# EAGLE design umodular_midi4_rev02 (EAGLE 7.2.0)
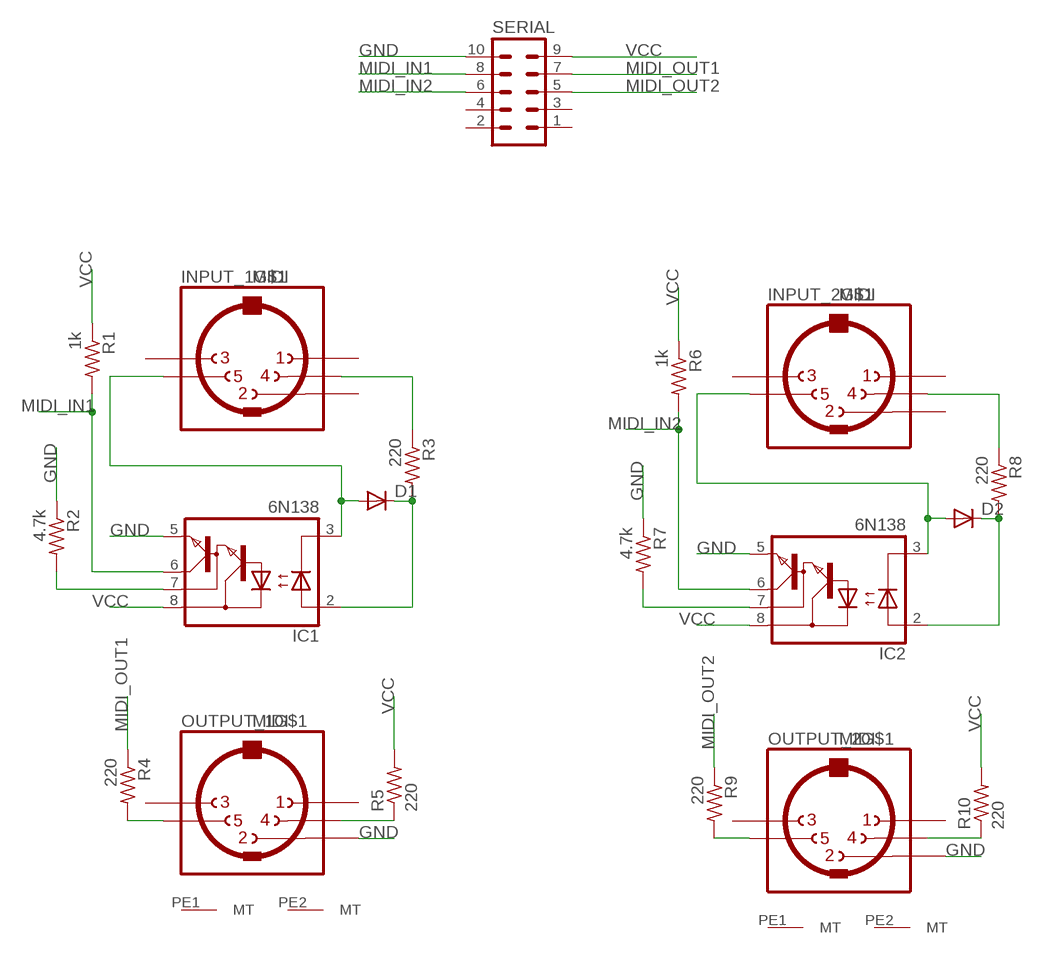
[diagram p0: schematic, sheet 1]

## Parts
D1  1N4148DO35-7  [DO35-7]
D2  1N4148DO35-7  [DO35-7]
IC1  6N138  [DIL08]
IC2  6N138  [DIL08]
INPUT_1  MIDI  MIDIJACK  [CP-2350]
INPUT_2  MIDI  MIDIJACK  [CP-2350]
OUTPUT_1  MIDI  MIDIJACK  [CP-2350]
OUTPUT_2  MIDI  MIDIJACK  [CP-2350]
R1  1k  R-US_0204/7  [0204/7@1]
R2  4.7k  R-US_0204/7  [0204/7@1]
R3  220  R-US_0204/7  [0204/7@1]
R4  220  R-US_0204/7  [0204/7@1]
R5  220  R-US_0204/7  [0204/7@1]
R6  1k  R-US_0204/7  [0204/7@1]
R7  4.7k  R-US_0204/7  [0204/7@1]
R8  220  R-US_0204/7  [0204/7@1]
R9  220  R-US_0204/7  [0204/7@1]
R10  220  R-US_0204/7  [0204/7@1]
SERIAL  MA05-2  [MA05-2]

## Nets
GND: IC1.5(GND) IC2.5(GND) OUTPUT_1.2 OUTPUT_2.2 R2.1 R7.1 SERIAL.10
MIDI_IN1: IC1.6(VO) R1.2 SERIAL.8
MIDI_IN2: IC2.6(VO) R6.2 SERIAL.6
MIDI_OUT1: R4.1 SERIAL.7
MIDI_OUT2: R9.1 SERIAL.5
N$1: OUTPUT_2.4 R10.1
N$2: OUTPUT_2.5 R9.2
N$3: INPUT_2.4 R8.1
N$4: D2.C IC2.2(A) R8.2
N$5: D2.A IC2.3(C) INPUT_2.5
N$6: IC2.7(VB) R7.2
N$330: INPUT_1.4 R3.1
N$331: OUTPUT_1.4 R5.1
N$332: OUTPUT_1.5 R4.2
N$333: D1.C IC1.2(A) R3.2
N$336: D1.A IC1.3(C) INPUT_1.5
N$337: IC1.7(VB) R2.2
VCC: IC1.8(VCC) IC2.8(VCC) R1.1 R5.2 R6.1 R10.2 SERIAL.9
Unconnected: INPUT_1.1 INPUT_1.2 INPUT_1.3 INPUT_1.PE1(MT) INPUT_1.PE2(MT) INPUT_1.PE(MT) INPUT_1.PE@(MT) INPUT_2.1 INPUT_2.2 INPUT_2.3 INPUT_2.PE1(MT) INPUT_2.PE2(MT) INPUT_2.PE(MT) INPUT_2.PE@(MT) OUTPUT_1.1 OUTPUT_1.3 OUTPUT_1.PE1(MT) OUTPUT_1.PE2(MT) OUTPUT_1.PE(MT) OUTPUT_1.PE@(MT) OUTPUT_2.1 OUTPUT_2.3 OUTPUT_2.PE1(MT) OUTPUT_2.PE2(MT) OUTPUT_2.PE(MT) OUTPUT_2.PE@(MT) SERIAL.1 SERIAL.2 SERIAL.3 SERIAL.4

## Library data of the parts
D1 D2 = diode:1N4148: DIODE high speed (Philips)
IC1 IC2 = optocoupler:6N138: MOTOROLA OPTO COUPLER; MF: VISHAY/TELEFUNKEN; MPN: 6N138; OC_FARNELL: 9860150; OC_NEWARK: 35K5294
INPUT_1 INPUT_2 OUTPUT_1 OUTPUT_2 = adafruit:MIDIJACK: DIN 5 jack also known as MIDI jack A modification of conn-hirshman:MAB5SH with two options for the grounding 'teeth'
R1-R10 = rcl:R-US_: RESISTOR, American symbol
SERIAL = con-lstb:MA05-2: PIN HEADER; OC_FARNELL: unknown; OC_NEWARK: unknown

## Net classes
0 default: width 0.305 mm

## Board
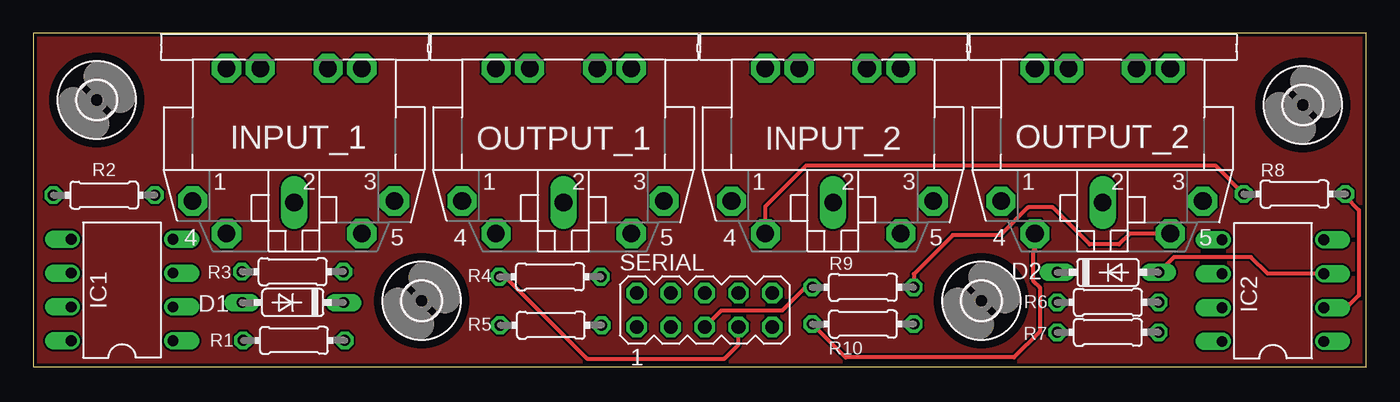
[diagram p1: board, top side]
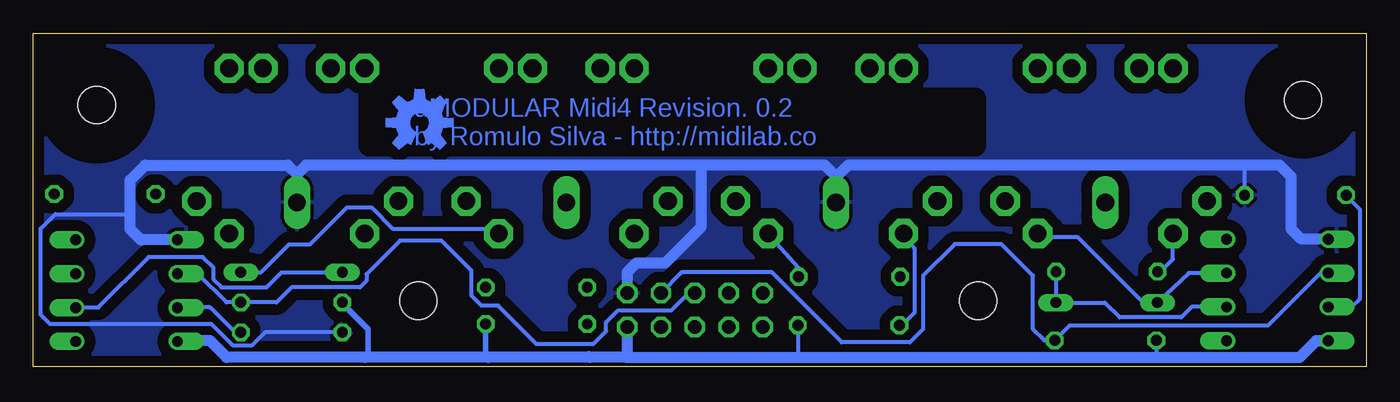
[diagram p2: board, bottom side, seen from below]

Size 100 x 25 mm. Coordinates in mm from the lower left corner, seen from the top.
Outline: 0,0 100,0 100,25 0,25 0,0
Copper layers (1*16): Top 0.035mm / dielectric 1.5mm / Bottom 0.035mm
Design rules "SeeedStudio_2layer_DRU_no_angle_20140221": minimum track width 6mil, minimum drill 12mil, track to track 6mil, track to pad 6mil, pad to pad 6mil, via to via 6mil, smd to smd 0mil, copper to edge 10mil, drill to drill 10mil, minimum pad ring 10mil, minimum via ring 6mil, stop-mask expansion 2mil, vias tented up to drill 100mil, thermal gap 10mil

### Footprints (pad centres in the part's own frame; a part is rotated, then mirrored left to right if it is on the bottom)
DO35-7 = drill 0.813 long: A 3.81,0; C -3.81,0
DIL08 = drill 0.813 offset: 1 -3.81,-3.81; 2 -1.27,-3.81; 3 1.27,-3.81; 4 3.81,-3.81; 5 3.81,3.81; 6 1.27,3.81; 7 -1.27,3.81; 8 -3.81,3.81
CP-2350 = drill 1.321 pad 2.184 octagon: 1 7.62,12.58; 3 -7.52,12.58; 4 5.08,15.02; 5 -5.08,15.02; PE -2.54,2.62; PE1 -5.08,2.62; PE2 5.08,2.62; PE@ 2.54,2.62 | drill 1.321 long: 2 0,12.68
0204/7@1 = drill 0.813 octagon: 1 -3.81,0; 2 3.81,0
MA05-2 = drill 1.016 octagon: 1 -5.08,-1.27; 2 -5.08,1.27; 3 -2.54,-1.27; 4 -2.54,1.27; 5 0,-1.27; 6 0,1.27; 7 2.54,-1.27; 8 2.54,1.27; 9 5.08,-1.27; 10 5.08,1.27
2,8 = hole 2.8: 0,0

### Placement (x,y rotation side)
D1  19.47,4.81 180 top
D2  80.62,7.08 0 top
IC1  6.66,5.75 90 top
IC2  93,5.7 90 top
INPUT_1  19.57,25 180 top
INPUT_2  60,25 180 top
OUTPUT_1  39.78,25 180 top
OUTPUT_2  80.22,25 180 top
R1  19.55,1.97 0 top
R2  5.32,12.87 180 top
R3  19.45,7.12 0 top
R4  38.77,6.74 0 top
R5  38.83,3.11 0 top
R6  80.62,4.83 0 top
R7  80.62,2.58 0 top
R8  94.62,12.95 0 top
R9  62.25,5.95 0 top
R10  62.25,3.2 0 top
SERIAL  50.37,4.25 0 top
U$1  [2,8]  29.12,4.95 0 top
U$2  [2,8]  4.75,20 0 top
U$3  [2,8]  95.25,19.62 0 top
U$4  [2,8]  71.12,4.95 0 top
U$6  [OSHW-LOGO-M_COPPER]  71.03,18.3 0 top

### Tracks (layer width: path | path; a pad name or v marks a point on that pad's centre or on a via)
GND
  Bottom 0.305: R7.1 82.62,2.58 83.62,1.57 85,1.57 86.62,3.2 98.75,3.2 99.45,3.9 99.45,10.35 98.35,11.45 93,11.45 92.75,11.07 | R2.1 9.12,15 9,15.12
  Bottom 0.813: 39.88,14.12 39.88,14.38 40.62,15.12 50.12,15.12 | OUTPUT_1.2 39.88,12.12 39.88,14.12 | IC1.5 4.86,9.56 5.62,10.32 5.62,14.25 6.5,15.12 9,15.12 38.88,15.12 39.88,14.12 | IC2.5 91.94,9.51 92.75,10.32 92.75,11.07 92.75,14 91.62,15.12 80.9,15.12 80.22,14.45 | SERIAL.10 55.45,7.1 54.77,7.78 52.6,7.78 49.88,10.5 49.88,14.88 50.12,15.12 | 80.22,14.45 OUTPUT_2.2 | 50.12,15.12 79.55,15.12 80.22,14.45
  pour Bottom (isolate 0.813): 0,25 100.25,25.25 100.25,-0.12 0,-0.38
MIDI_IN1
  Bottom 0.305: IC1.6 3.43,7.02 7.38,3.08 22.26,3.08 R1.2 24.14,1.97 25,2.83 25,6.83 27.38,9.2 30.88,9.2 33.25,6.83 33.25,2.83 34.25,1.82 39.35,1.82 44.6,7.08 51.35,7.08 SERIAL.8
MIDI_IN2
  Bottom 0.305: IC2.6 89.17,6.95 87.62,6.95 85.5,4.83 R6.2 81.75,4.83 80.62,5.95 75.5,5.95 75,6.45 75,6.95 72.5,9.45 69.38,9.45 67.12,7.2 67.12,5.33 66.38,4.58 65.12,4.58 62.25,1.7 58,1.7 57.02,2.67 57.02,3.33 56.12,4.22 52.12,4.22 50.88,5.47 50.41,5.47 SERIAL.6
MIDI_OUT1
  Top 0.305: R4.1 35.41,6.74 41.55,0.6 51.85,0.6 52.9,1.65 SERIAL.7
MIDI_OUT2
  Top 0.305: SERIAL.5 50.38,2.98 51.62,4.22 56.19,4.22 57.91,5.95 R9.1
N$1
  Top 0.305: OUTPUT_2.4 75.14,8.79 75,8.65 75,6.45 75.5,5.95 75.5,2.62 73.58,0.7 60.94,0.7 R10.1
N$2
  Top 0.305: OUTPUT_2.5 82.25,9.98 81.45,9.18 79.25,9.18 76.47,11.95 74.62,11.95 72.55,9.88 68.97,9.88 66.05,6.95 R9.2
N$3
  Top 0.305: INPUT_2.4 54.92,12.02 58,15.1 88.67,15.1 R8.1
N$4
  Top 0.305: R8.2 98.44,12.77 99.45,11.75 99.45,5.35 98.55,4.45 96.83,4.45 IC2.2
  Bottom 0.305: IC2.2 96.83,4.45 95.12,4.45 91.35,8.22 87.28,8.22 86.5,7.45 86.5,6.58 85.88,5.95 82.5,5.95 81.38,7.08 D2.C
N$5
  Top 0.305: IC2.3 92.61,6.97 91.35,8.22 85.58,8.22 D2.A
  Bottom 0.305: D2.A 82.92,7.08 80.83,9.18 79.25,9.18 76.47,11.95 74.62,11.95 73.03,10.35 65.45,10.35 INPUT_2.5
N$6
  Bottom 0.305: R7.2 84.88,2.58 86.75,4.45 89.17,4.45 IC2.7
N$7
  pour Top: -0.15,25.1 100.25,25.1 100.25,-0.25 -0.15,-0.25
N$330
  Bottom 0.305: R3.1 15.45,7.12 14.5,8.07 14.5,9.68 INPUT_1.4
N$331
  Bottom 0.305: R5.1 34.84,3.11 33.88,4.08 33.88,8.86 OUTPUT_1.4
N$332
  Bottom 0.305: R4.2 42.59,7.41 OUTPUT_1.5
N$333
  Bottom 0.305: R3.2 23.27,5.2 D1.C 19.61,4.81 18.5,3.7 13.88,3.7 13.1,4.48 IC1.2
N$336
  Bottom 0.305: IC1.3 13.32,7.02 D1.A 16.73,4.81 21.62,9.7 24.64,9.7 INPUT_1.5
N$337
  Bottom 0.305: R2.2 1.5,12.83 0.5,11.82 0.5,5.08 1.12,4.45 2.82,4.45 IC1.7
VCC
  Bottom 0.305: R5.2 42.64,0.84 42.5,0.7 | R1.1 15.74,0.83 15.88,0.7
  Bottom 0.406: R6.1 76.81,4.76 74.88,2.83 74.88,0.95 75.12,0.7 | R10.2 66.06,0.89 65.88,0.7
  Bottom 0.813: 58.25,0.7 55.5,0.7 55.45,0.76 SERIAL.9 55.45,0.77 55.38,0.7 42.5,0.7 15.88,0.7 5,0.7 3.75,1.95 3.48,1.95 IC1.8 | 58.25,0.7 65.88,0.7 75.12,0.7 85.5,0.7 86.75,1.95 89,1.95 IC2.8 | 58.31,0.77 58.25,0.7

### Text on the board
Bottom: uMODULAR Midi4 Revision. 0.2 / by Romulo Silva - http://midilab.co